# Altium project Motor_Control_Board.PrjPcb
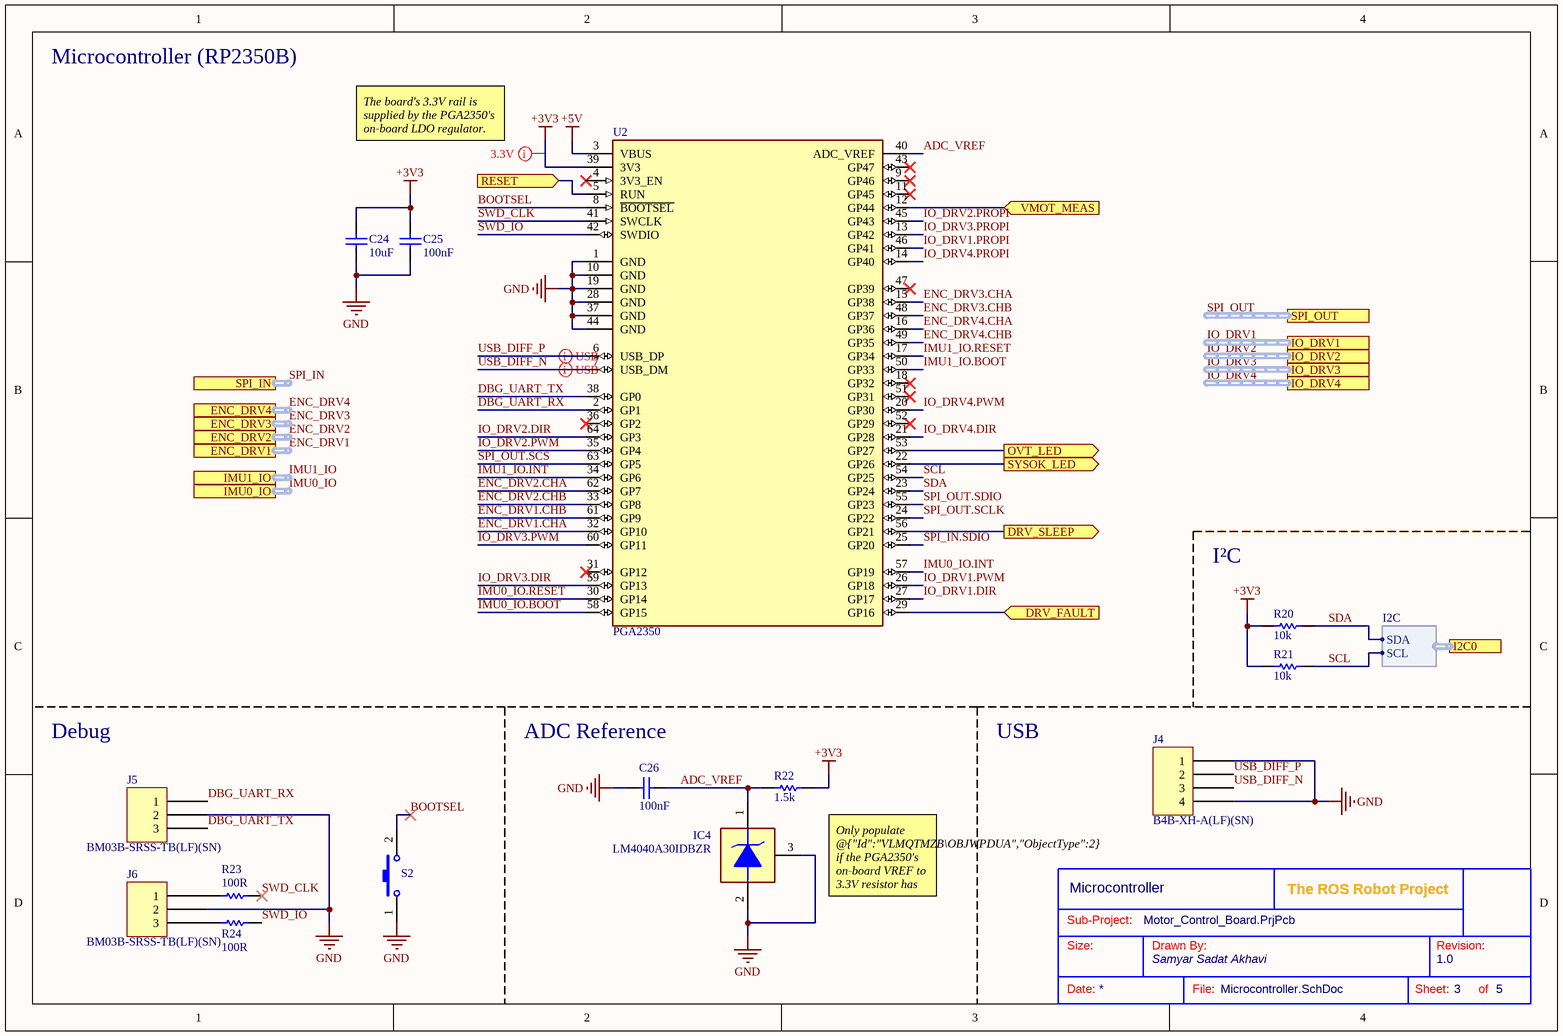
[diagram p0: Microcontroller.SchDoc]
MainProjectName: The ROS Robot Project
2 sheets, 36 parts. Net scope: flat (ports and power ports of the same name join across sheets).
Board file: Motor_Control_Board.PcbDoc
Sheets:
  Microcontroller.SchDoc
  Motor_Driver.SchDoc

## Sheet Microcontroller.SchDoc: Microcontroller
size A4; DrawnBy: Samyar Sadat Akhavi; Revision: 1.0; SheetNumber: 3; SheetTotal: 5

### Parts
(Parts that share a designator on the sheet are numbered #1, #2 ... from top to bottom, then left to right.)
?#1  (no value)  (graphical)
C24  10uF  [CAP_SMD_805]
C25  100nF  [CAP_SMD_603]
C26  100nF  [CAP_SMD_603]
IC4  LM4040A30IDBZR  [SOT95P237X112-3N]
J4  B4B-XH-A(LF)(SN)  [JST XH B4B-XH-A]
J5  BM03B-SRSS-TB(LF)(SN)  [JST BM03B-SRSS-TB]
J6  BM03B-SRSS-TB(LF)(SN)  [JST BM03B-SRSS-TB]
R20  10k  [RES_0603]
R21  10k  [RES_0603]
R22  1.5k  [RES_0603]
R23  100R  [RES_0603]
R24  100R  [RES_0603]
S2  PTS815_SJK_250_SMTR_LFS  [PTS815SJK250SMTRLFS]  (value not drawn)
U2  PGA2350  [PGA2350]

### Ports
DRV_FAULT (in, see Motor_Control_Board[2B]), DRV_SLEEP (out, see Motor_Control_Board[2B]), ENC_DRV1 (harness Encoder, see Motor_Control_Board[2B]), ENC_DRV2 (harness Encoder, see Motor_Control_Board[2B]), ENC_DRV3 (harness Encoder, see Motor_Control_Board[2B]), ENC_DRV4 (harness Encoder, see Motor_Control_Board[2B]), I2C0 (harness I2C, see Motor_Control_Board[2B], Sensors[4D]), IMU0_IO (harness IMU_IO, see Motor_Control_Board[2B], Sensors[2A]), IMU1_IO (harness IMU_IO, see Motor_Control_Board[2B], Sensors[2B]), IO_DRV1 (harness Drive_IO, see Motor_Control_Board[2B]), IO_DRV2 (harness Drive_IO, see Motor_Control_Board[2B]), IO_DRV3 (harness Drive_IO, see Motor_Control_Board[2B]), IO_DRV4 (harness Drive_IO, see Motor_Control_Board[2B]), OVT_LED (out, see Motor_Control_Board[2B]), RESET (in, see Motor_Control_Board[2B], Power_Reset[2A]), SPI_IN (harness SPI_Uni, see Motor_Control_Board[2B]), SPI_OUT (harness SPI_Uni, see Motor_Control_Board[2B]), SYSOK_LED (out, see Motor_Control_Board[2B]), VMOT_MEAS (in, see Motor_Control_Board[2B], Power_Reset[2D])

### Harnesses
I2C: SDA, SCL

### Nets
+3V3: C24.2 C25.2 R20.2 R21.2 R22.2 U2.39(3V3)
+5V: U2.3(VBUS)
GND: C24.1 C25.1 C26.2 IC4.2(A) IC4.3 J4.1 J4.4 J5.2 J6.2 S2.1(COM) U2.1(GND) U2.10(GND) U2.19(GND) U2.28(GND) U2.37(GND) U2.44(GND)
ADC_VREF: C26.1 IC4.1(K) R22.1 U2.40(ADC_VREF)
BOOTSEL: S2.2(NO) U2.8(~{BOOTSEL})
DBG_UART_RX: J5.1 U2.2(GP1)
DBG_UART_TX: J5.3 U2.38(GP0)
ENC_DRV1.CHA: U2.32(GP10)
ENC_DRV1.CHB: U2.61(GP9)
ENC_DRV2.CHA: U2.62(GP7)
ENC_DRV2.CHB: U2.33(GP8)
ENC_DRV3.CHA: U2.15(GP38)
ENC_DRV3.CHB: U2.48(GP37)
ENC_DRV4.CHA: U2.16(GP36)
ENC_DRV4.CHB: U2.49(GP35)
IMU0_IO.BOOT: U2.58(GP15)
IMU0_IO.INT: U2.57(GP19)
IMU0_IO.RESET: U2.30(GP14)
IMU1_IO.BOOT: U2.50(GP33)
IMU1_IO.INT: U2.34(GP6)
IMU1_IO.RESET: U2.17(GP34)
IO_DRV1.DIR: U2.27(GP17)
IO_DRV1.PROPI: U2.46(GP41)
IO_DRV1.PWM: U2.26(GP18)
IO_DRV2.DIR: U2.64(GP3)
IO_DRV2.PROPI: U2.45(GP43)
IO_DRV2.PWM: U2.35(GP4)
IO_DRV3.DIR: U2.59(GP13)
IO_DRV3.PROPI: U2.13(GP42)
IO_DRV3.PWM: U2.60(GP11)
IO_DRV4.DIR: U2.21(GP28)
IO_DRV4.PROPI: U2.14(GP40)
IO_DRV4.PWM: U2.20(GP30)
SCL: R21.1 U2.54(GP25) ; port I2C0.SCL
SDA: R20.1 U2.23(GP24) ; port I2C0.SDA
SPI_IN.SDIO: U2.25(GP20)
SPI_OUT.SCLK: U2.24(GP22)
SPI_OUT.SCS: U2.63(GP5)
SPI_OUT.SDIO: U2.55(GP23)
SWD_CLK: R23.1 U2.41(SWCLK)
SWD_IO: R24.1 U2.42(SWDIO)
USB_DIFF_N: J4.3 U2.7(USB_DM)
USB_DIFF_P: J4.2 U2.6(USB_DP)
NetJ6_1: J6.1 R23.2
NetJ6_3: J6.3 R24.2
NetU2_5: U2.5(RUN) ; port RESET
NetU2_12: U2.12(GP44) ; port VMOT_MEAS
NetU2_22: U2.22(GP26) ; port SYSOK_LED
NetU2_29: U2.29(GP16) ; port DRV_FAULT
NetU2_53: U2.53(GP27) ; port OVT_LED
NetU2_56: U2.56(GP21) ; port DRV_SLEEP

Not connected (* = marked no-connect by the designer): U2 4(3V3_EN)* 9(GP46)* 11(GP45)* 18(GP32)* 31(GP12)* 36(GP2)* 43(GP47)* 47(GP39)* 51(GP31)* 52(GP29)*

### Buses and harness runs
harness ENC_DRV1 = port ENC_DRV1
harness ENC_DRV2 = port ENC_DRV2
harness ENC_DRV3 = port ENC_DRV3
harness ENC_DRV4 = port ENC_DRV4
harness IMU0_IO = port IMU0_IO
harness IMU1_IO = port IMU1_IO
harness IO_DRV1 = port IO_DRV1
harness IO_DRV2 = port IO_DRV2
harness IO_DRV3 = port IO_DRV3
harness IO_DRV4 = port IO_DRV4
harness SPI_IN = port SPI_IN
harness SPI_OUT = port SPI_OUT

### Layout directives
differential pair: USB_DIFF_N, USB_DIFF_P
rule Supply Nets [Voltage = 3.300]; net class POWER: +3V3

### Notes on the sheet
- Microcontroller (RP2350B)
- The board's 3.3V rail is supplied by the PGA2350's on-board LDO regulator.
- I²C
- Debug
- (near C26) ADC Reference
- USB
- Only populate @{"Id":"VLMQTMZB\OBJWPDUA","ObjectType":2} if the PGA2350's on-board VREF to 3.3V resistor has been removed.
- Sub-Project:
- Size:
- Drawn By:
- Revision:
- Date:
- File:
- Sheet:
- of

### Library data of the parts
?#1 = Standard Title Block
C24-C26 = Non-polar Capacitor: Generic Ceramic Capacitor; Voltage: 6.3V
  C24: Value: 10uF
  C25 C26: Value: 100nF
IC4 = LM4040A30IDBZR: Integrated Circuit; Manufacturer_Name: Texas Instruments; Datasheet Link: https://www.ti.com/lit/ds/symlink/lm4040.pdf?ts=1622708080852&ref_url=https%253A%252F%252Fwww.ti.com%252Fsitesearch%252Fdocs%252Funiversalsearch.tsp%253FlangPref%253Den-US%2526searchTerm%253DLM4040A30IDBZR%2526nr%253D15; Height: 1.12mm; Manufacturer_Part_Number: LM4040A30IDBZR; Mouser Part Number: 595-LM4040A30IDBZR; Mouser Price/Stock: https://www.mouser.co.uk/ProductDetail/Texas-Instruments/LM4040A30IDBZR?qs=VBduBm9rCJQGyTICzc6%2FQg%3D%3D; Arrow Part Number: LM4040A30IDBZR; Arrow Price/Stock: https://www.arrow.com/en/products/lm4040a30idbzr/texas-instruments?region=nac
J4 = B4B-XH-A(LF)(SN): CONN HEADER VERT 4POS 2.5MM; Manufacturer: JST Sales America Inc.; Contact Length - Post: 0.134" (3.40mm); Current Rating (Amps): 3A; Material Flammability Rating: UL94 V-0; Number of Positions: 4; Number of Positions Loaded: All; Pitch - Mating: 0.098" (2.50mm); Shrouding: Shrouded - 4 Wall; Style: Board to Cable/Wire; Voltage Rating: 250V; System: Connector; Part Number: B4B-XH-A(LF)(SN); ComponentLink1Description: Datasheet; ComponentLink1URL: http://www.jst-mfg.com/product/pdf/eng/eXH.pdf; ComponentLink2Description: DigiKey Link; ComponentLink2URL: http://digikey.com/product-detail/en/jst-sales-america-inc/B4B-XH-A-LF-SN/455-2249-ND/1651047; Connector Type: Header; Contact Finish - Mating: Tin; Contact Finish - Post: Tin; Contact Material: Brass; Contact Shape: Square; Contact Type: Male Pin; Fastening Type: Detent Lock; Insulation Color: Natural; Insulation Height: 0.276" (7.00mm); Insulation Material: Polyamide (PA66), Nylon 6/6; LastUpdated: 1/12/2020 11:46:34 PM; Lifecycle Status: Active; Minimum Order: 1; Mounting Type: Through Hole; Number of Rows: 1; Operating Temperature: -25°C ~ 85°C; Packaging: Bulk; PartId: 69; Part Status: Active; Price: 0.21; Series: XH; Supplier 1: DigiKey; Supplier Part Number 1: 455-2249-ND; Termination: Press-Fit, Solder
J5 J6 = BM03B-SRSS-TB(LF)(SN): CONN HEADER SMD 3POS 1MM; Manufacturer: JST Sales America Inc.; Current Rating (Amps): 0.7A; Material Flammability Rating: UL94 V-0; Number of Positions: 3; Number of Positions Loaded: All; Pitch - Mating: 0.039" (1.00mm); Shrouding: Shrouded - 4 Wall; Style: Board to Cable/Wire; Voltage Rating: 50V; Part Number: BM03B-SRSS-TB(LF)(SN); ComponentLink1Description: Datasheet; ComponentLink1URL: http://www.jst-mfg.com/product/pdf/eng/eSR.pdf; ComponentLink2Description: DigiKey Link; ComponentLink2URL: http://digikey.com/product-detail/en/jst-sales-america-inc/BM03B-SRSS-TB-LF-SN/455-1789-1-ND/926860; Connector Type: Header; Contact Finish - Mating: Tin; Contact Finish - Post: Tin; Contact Material: Copper Alloy; Contact Shape: Square; Contact Type: Male Pin; Fastening Type: Push-Pull; Features: Solder Retention; Insulation Color: Natural; Insulation Height: 0.167" (4.25mm); Insulation Material: Polyamide (PA), Nylon; LastUpdated: 1/12/2020 10:12:14 PM; Lifecycle Status: Active; Minimum Order: 1; Mounting Type: Surface Mount; Number of Rows: 1; Operating Temperature: -25°C ~ 85°C; Packaging: TapeAndReel; PartId: 14; Part Status: Active; Price: 0.24; Series: SR; Supplier 1: DigiKey; Supplier Part Number 1: 455-1789-1-ND; Termination: Solder
R20-R24 = Resistor: Power: 1/8W
  R20 R21: Value: 10k
  R22: Value: 1.5k
  R23 R24: Value: 100R
S2 = PTS815_SJK_250_SMTR_LFS: Switch; Manufacturer_Name: C & K COMPONENTS; Manufacturer_Part_Number: PTS815 SJK 250 SMTR LFS; Datasheet Link: https://www.mouser.com/datasheet/2/60/pts815-1535658.pdf; Height: 2mm; Mouser Part Number: 611-PTS815SJK250SMTR; Mouser Price/Stock: https://www.mouser.co.uk/ProductDetail/CK/PTS815-SJK-250-SMTR-LFS?qs=ahcBuItHZ3yETpGYMHf%2FgQ%3D%3D; Arrow Part Number: PTS815 SJK 250 SMTR LFS; Arrow Price/Stock: https://www.arrow.com/en/products/pts815-sjk-250-smtr-lfs/ck
U2 = PGA2350: RP2350B carrier module; Manufacturer: Pimoroni Ltd.; Part Number: PGA2350; Supplier 1: DigiKey; Supplier Part Number 1: 1778-PIM722-ND

## Sheet Motor_Driver.SchDoc: Single Motor Driver
size A4; DrawnBy: Samyar Sadat Akhavi; Revision: 1.0; SheetNumber: 4; SheetTotal: 5; SPICEModelCacheJDKEGQXN: <root> / <DocumentId>JDKEGQXN</DocumentId> / </root>
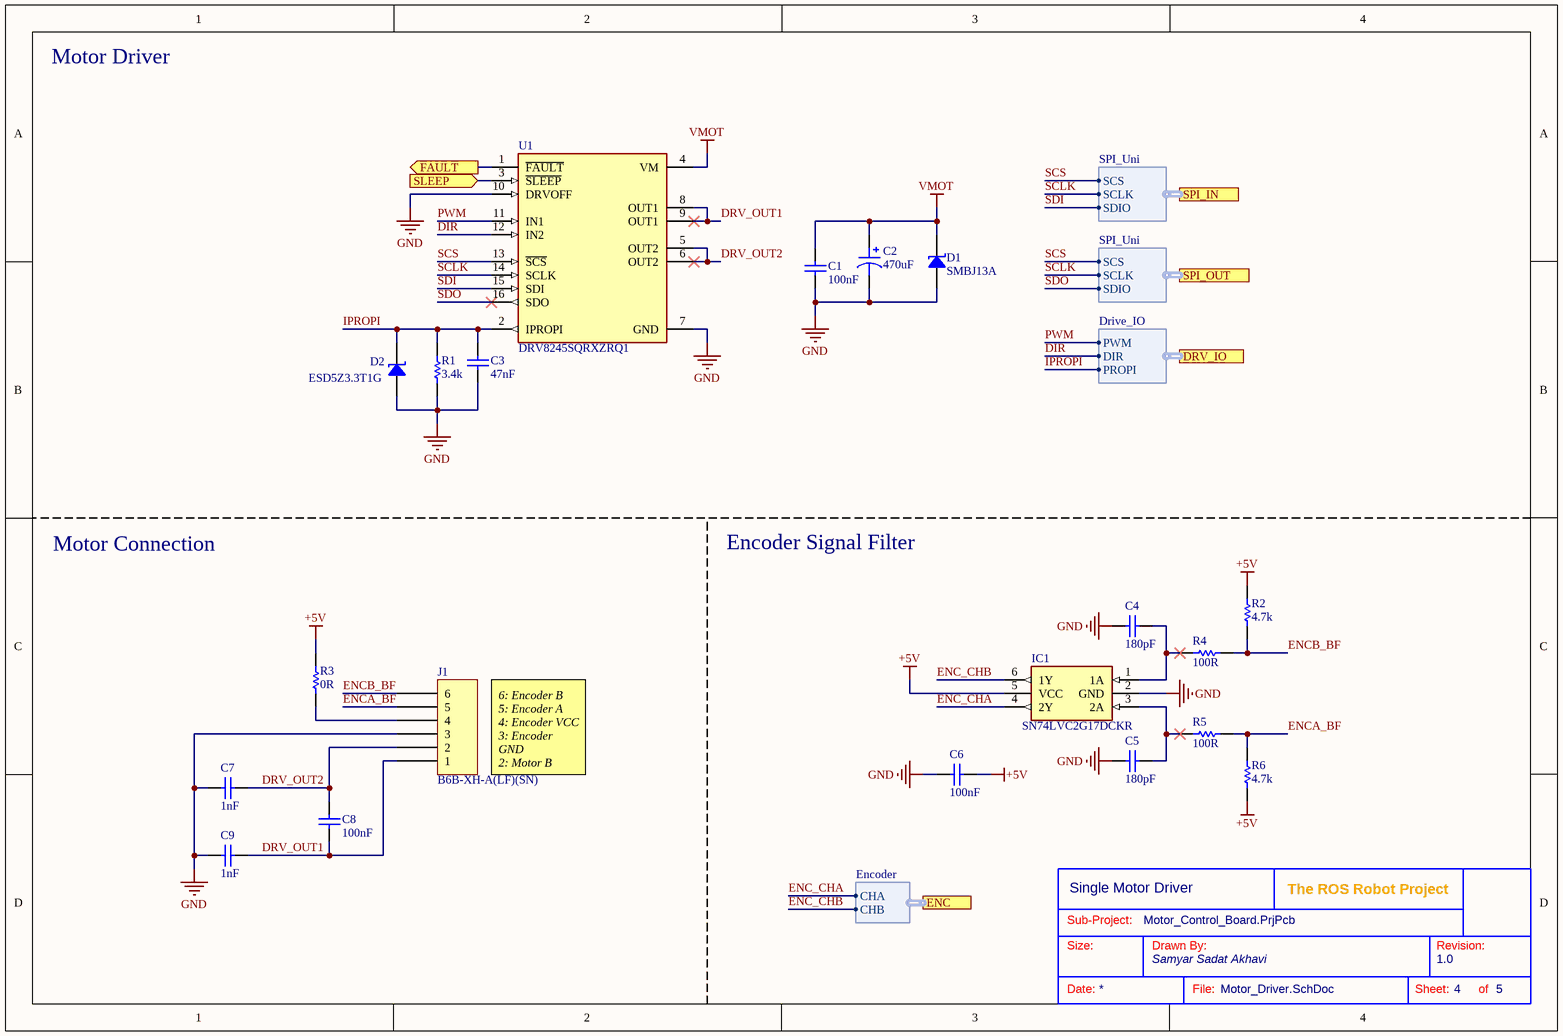
[diagram p1: Motor_Driver.SchDoc]

### Parts
(Parts that share a designator on the sheet are numbered #1, #2 ... from top to bottom, then left to right.)
?#2  (no value)  (graphical)
C1  100nF  [CAP_SMD_603]
C2  470uF  [CAP TH ALUM ELEC D8.00mm S3.50mm H11.50mm]
C3  47nF  [CAP_SMD_603]
C4  180pF  [CAP_SMD_603]
C5  180pF  [CAP_SMD_603]
C6  100nF  [CAP_SMD_603]
C7  1nF  [CAP_SMD_603]
C8  100nF  [CAP_SMD_1206]
C9  1nF  [CAP_SMD_603]
D1  SMBJ13A  [DO214AA SMB]
D2  ESD5Z3.3T1G  [SOD523F]
IC1  SN74LVC2G17DCKR  [SOP65P210X110-6N]
J1  B6B-XH-A(LF)(SN)  [JST XH B6B-XH-A]
R1  3.4k  [RES_0603]
R2  4.7k  [RES_0603]
R3  0R  [RES_0603]
R4  100R  [RES_0603]
R5  100R  [RES_0603]
R6  4.7k  [RES_0603]
U1  DRV8245SQRXZRQ1  [RXZ0016A-MFG]

### Ports
DRV_IO (harness Drive_IO, see Motor_Control_Board[4A]), ENC (harness Encoder, see Motor_Control_Board[4A]), FAULT (out, see Motor_Control_Board[4A]), SLEEP (in, see Motor_Control_Board[4A]), SPI_IN (harness SPI_Uni, see Motor_Control_Board[4A]), SPI_OUT (harness SPI_Uni, see Motor_Control_Board[4A])

### Harnesses
Encoder: CHA, CHB
Drive_IO: PWM, DIR, PROPI
SPI_Uni: SCS, SCLK, SDIO

### Nets
+5V: C6.2 IC1.5(VCC) R2.1 R3.1 R6.2
GND: C1.1 C2.2 C3.1 C4.2 C5.2 C6.1 C7.2 C9.2 D1.1 D2.1 IC1.2(GND) J1.3 R1.1 U1.7(GND) U1.10(DRVOFF)
VMOT: C1.2 C2.1 D1.2 U1.4(VM)
DIR: U1.12(IN2) ; port DRV_IO.DIR
DRV_OUT1: C8.1 C9.1 J1.1 U1.8(OUT1) U1.9(OUT1)
DRV_OUT2: C7.1 C8.2 J1.2 U1.5(OUT2) U1.6(OUT2)
ENC_CHA: IC1.4(2Y) ; port ENC.CHA
ENC_CHB: IC1.6(1Y) ; port ENC.CHB
ENCA_BF: J1.5 R5.1 R6.1
ENCB_BF: J1.6 R2.2 R4.1
IPROPI: C3.2 D2.2 R1.2 U1.2(IPROPI) ; port DRV_IO.PROPI
PWM: U1.11(IN1) ; port DRV_IO.PWM
SCLK: U1.14(SCLK) ; port SPI_IN.SCLK, port SPI_OUT.SCLK
SCS: U1.13(~{SCS}) ; port SPI_IN.SCS, port SPI_OUT.SCS
SDI: U1.15(SDI) ; port SPI_IN.SDIO
SDO: U1.16(SDO) ; port SPI_OUT.SDIO
NetC4_1: C4.1 IC1.1(1A) R4.2
NetC5_1: C5.1 IC1.3(2A) R5.2
NetJ1_4: J1.4 R3.2
NetU1_1: U1.1(~{FAULT}) ; port FAULT
NetU1_3: U1.3(~{SLEEP}) ; port SLEEP

### Notes on the sheet
- Motor Driver
- Motor Connection
- Encoder Signal Filter
- 6: Encoder B
  5: Encoder A
  4: Encoder VCC
  3: Encoder GND
  2: Motor B
  1: Motor A
- Sub-Project:
- Size:
- Drawn By:
- Revision:
- Date:
- File:
- Sheet:
- of

### Library data of the parts
?#2 = Standard Title Block
C1 = Non-polar Capacitor: Generic Ceramic Capacitor; Voltage: 25V; Value: 100nF
C2 = UVR1C471MPD1TA: CAP ALUM 470UF 20% 16V RADIAL; manufacturer: Nichicon; Lifetime @ Temp.: 2000 Hrs @ 85°C; Polarization: Polar; Ripple Current @ High Frequency: 660mA @ 10kHz; Ripple Current @ Low Frequency: 440mA @ 120Hz; Part Number: UVR1C471MPD1TA; Applications: General Purpose; Capacitance: 470uF; componentlink1description: Datasheet; componentlink1url: http://nichicon-us.com/english/products/pdfs/e-uvr.pdf; componentlink2description: DigiKey Link; componentlink2url: http://digikey.com/product-detail/en/nichicon/UVR1C471MPD1TA/UVR1C471MPD1TA-ND/2428037; Device Package: Radial, Can; Height - Seated (Max): 0.453" (11.50mm); lastupdated: 9/7/2020 5:24:50 AM; Lead Spacing: 0.138" (3.50mm); Lifecycle Status: Active; Minimum Order: 1000; Mounting Type: Through Hole; Operating Temperature: -40°C ~ 85°C; Package / Case: Radial, Can; packaging: TapeAndBox; partid: 23595; Part Status: Active; price: 0.08; series: UVR; Size / Dimension: 0.315" Dia (8.00mm); Supplier 1: DigiKey; Supplier Part Number 1: UVR1C471MPD1TA-ND; Tolerance: ±20%; value: 470uF; Voltage - Rated: 16V
C3-C6 = Non-polar Capacitor: Generic Ceramic Capacitor; Voltage: 6.3V
  C3: Value: 47nF
  C4 C5: Value: 180pF
  C6: Value: 100nF
C7-C9 = Non-polar Capacitor: Generic Ceramic Capacitor; Voltage: 100V
  C7 C9: Value: 1nF
  C8: Value: 100nF
D1 = SMBJ13A: TVS DIODE 13VWM 21.5VC SMB; Manufacturer: Bourns Inc.; Current - Peak Pulse (10/1000µs): 28A; Power Line Protection: No; Power - Peak Pulse: 600W; Type: Zener; Unidirectional Channels: 1; Voltage - Breakdown (Min): 14.4V; Voltage - Clamping (Max) @ Ipp: 21.5V; Voltage - Reverse Standoff (Typ): 13V; Part Number: SMBJ13A; Applications: General Purpose; ComponentLink1Description: Datasheet; ComponentLink1URL: https://www.bourns.com/docs/Product-Datasheets/SMBJ.pdf; ComponentLink2Description: DigiKey Link; ComponentLink2URL: https://www.digikey.com/en/products/detail/bourns-inc/SMBJ13A/2254626; LastUpdated: 6/3/2024 7:56:38 PM; Lifecycle Status: Active; Minimum Order: 1; Mounting Type: Surface Mount; Operating Temperature: -55°C ~ 150°C (TJ); Package / Case: DO-214AA, SMB; Packaging: TapeAndReel; PartId: 10876; Part Status: Active; Price: 0.08; Series: SMBJ; Supplier 1: DigiKey; Supplier Part Number 1: SMBJ13ABCT-ND; Supplier Device Package: DO-214AA (SMB)
D2 = ESD5Z3.3T1G: TVS DIODE 3.3V 14.1V SOD523; Manufacturer: ON Semiconductor; Capacitance @ Frequency: 105pF @ 1MHz; Current - Peak Pulse (10/1000µs): 11.2A (8/20µs); Power Line Protection: No; Power - Peak Pulse: 158W; Type: Zener; Unidirectional Channels: 1; Voltage - Breakdown (Min): 5V; Voltage - Reverse Standoff (Typ): 3.3V (Max); Part Number: ESD5Z3.3T1G; Applications: General Purpose; ComponentLink1Description: Datasheet; ComponentLink1URL: https://www.onsemi.com/pub/Collateral/ESD5Z2.5T1-D.PDF; ComponentLink2Description: DigiKey Link; ComponentLink2URL: http://digikey.com/product-detail/en/on-semiconductor/ESD5Z3.3T1G/ESD5Z3.3T1GOSCT-ND/1967044; LastUpdated: 6/3/2024 8:22:18 PM; Lifecycle Status: Active; Minimum Order: 1; Mounting Type: Surface Mount; Operating Temperature: -55°C ~ 150°C (TJ); Package / Case: SC-79, SOD-523; Packaging: TapeAndReel; PartId: 9754; Part Status: Active; Price: 0.04; Series: -; Supplier 1: DigiKey; Supplier Part Number 1: ESD5Z3.3T1GOSCT-ND; Supplier Device Package: SOD-523; Voltage - Clamping (Max) @ Ipp: 14.1V
IC1 = SN74LVC2G17DCKR: Integrated Circuit; Manufacturer_Name: Texas Instruments; Datasheet Link: http://www.ti.com/general/docs/suppproductinfo.tsp?distId=26&gotoUrl=http%3A%2F%2Fwww.ti.com%2Flit%2Fgpn%2Fsn74lvc2g17; Height: 1.1mm; Manufacturer_Part_Number: SN74LVC2G17DCKR; Mouser Part Number: 595-SN74LVC2G17DCKR; Mouser Price/Stock: https://www.mouser.co.uk/ProductDetail/Texas-Instruments/SN74LVC2G17DCKR?qs=spW5eSrOWB6kZFcYtrLxUQ%3D%3D; Arrow Part Number: SN74LVC2G17DCKR; Arrow Price/Stock: https://www.arrow.com/en/products/sn74lvc2g17dckr/texas-instruments?utm_currency=USD&region=europe
J1 = B6B-XH-A(LF)(SN): CONN HEADER VERT 6POS 2.5MM; Manufacturer: JST Sales America Inc.; Contact Length - Post: 0.134" (3.40mm); Current Rating (Amps): 3A; Material Flammability Rating: UL94 V-0; Number of Positions: 6; Number of Positions Loaded: All; Pitch - Mating: 0.098" (2.50mm); Shrouding: Shrouded - 4 Wall; Style: Board to Cable/Wire; Voltage Rating: 250V; System: Connector; Part Number: B6B-XH-A(LF)(SN); ComponentLink1Description: Datasheet; ComponentLink1URL: http://www.jst-mfg.com/product/pdf/eng/eXH.pdf; ComponentLink2Description: DigiKey Link; ComponentLink2URL: http://digikey.com/product-detail/en/jst-sales-america-inc/B6B-XH-A-LF-SN/455-2271-ND/1000381; Connector Type: Header; Contact Finish - Mating: Tin; Contact Finish - Post: Tin; Contact Material: Brass; Contact Shape: Square; Contact Type: Male Pin; Fastening Type: Detent Lock; Insulation Color: Natural; Insulation Height: 0.276" (7.00mm); Insulation Material: Polyamide (PA66), Nylon 6/6; LastUpdated: 1/12/2020 11:46:58 PM; Lifecycle Status: Active; Minimum Order: 1; Mounting Type: Through Hole; Number of Rows: 1; Operating Temperature: -25°C ~ 85°C; Packaging: Bulk; PartId: 71; Part Status: Active; Price: 0.27; Series: XH; Supplier 1: DigiKey; Supplier Part Number 1: 455-2271-ND; Termination: Press-Fit, Solder
R1 R2 R4-R6 = Resistor: Power: 1/8W
  R1: Value: 3.4k
  R2 R6: Value: 4.7k
  R4 R5: Value: 100R
R3 = Resistor: Value: 0R; Power: N/A
U1 = DRV8245SQRXZRQ1: Automotive 40-V, 32-A H-Bridge driver with integrated current sensing and feedback 16-VQFN-HR -40 to 125; Manufacturer_Name: Texas Instruments; TYPE: TYPE; RefDes: RefDes; Copyright: Copyright (C) 2025 Ultra Librarian. All rights reserved.; Manufacturer_Part_Number: DRV8245SQRXZRQ1

## Nets that join several sheets
+5V: Microcontroller (U2.3), Motor_Driver (5 pins)
GND: Microcontroller (16 pins), Motor_Driver (15 pins)